# Altium schematic sheet [05]-DOC-REVISION-HISTORY.SchDoc: Stackup & Calculations:
size A3; Ingenieur: Stephan Diel; Organization: Dr. Hönle AG; Address1: Lochhamer Schlag 1; Address2: 82166 Gräfelfing; Address3: Germany; Address4: www.hoenle.de; DocumentNumber: 5; Revision: e01; SheetNumber: 5; SheetTotal: 13
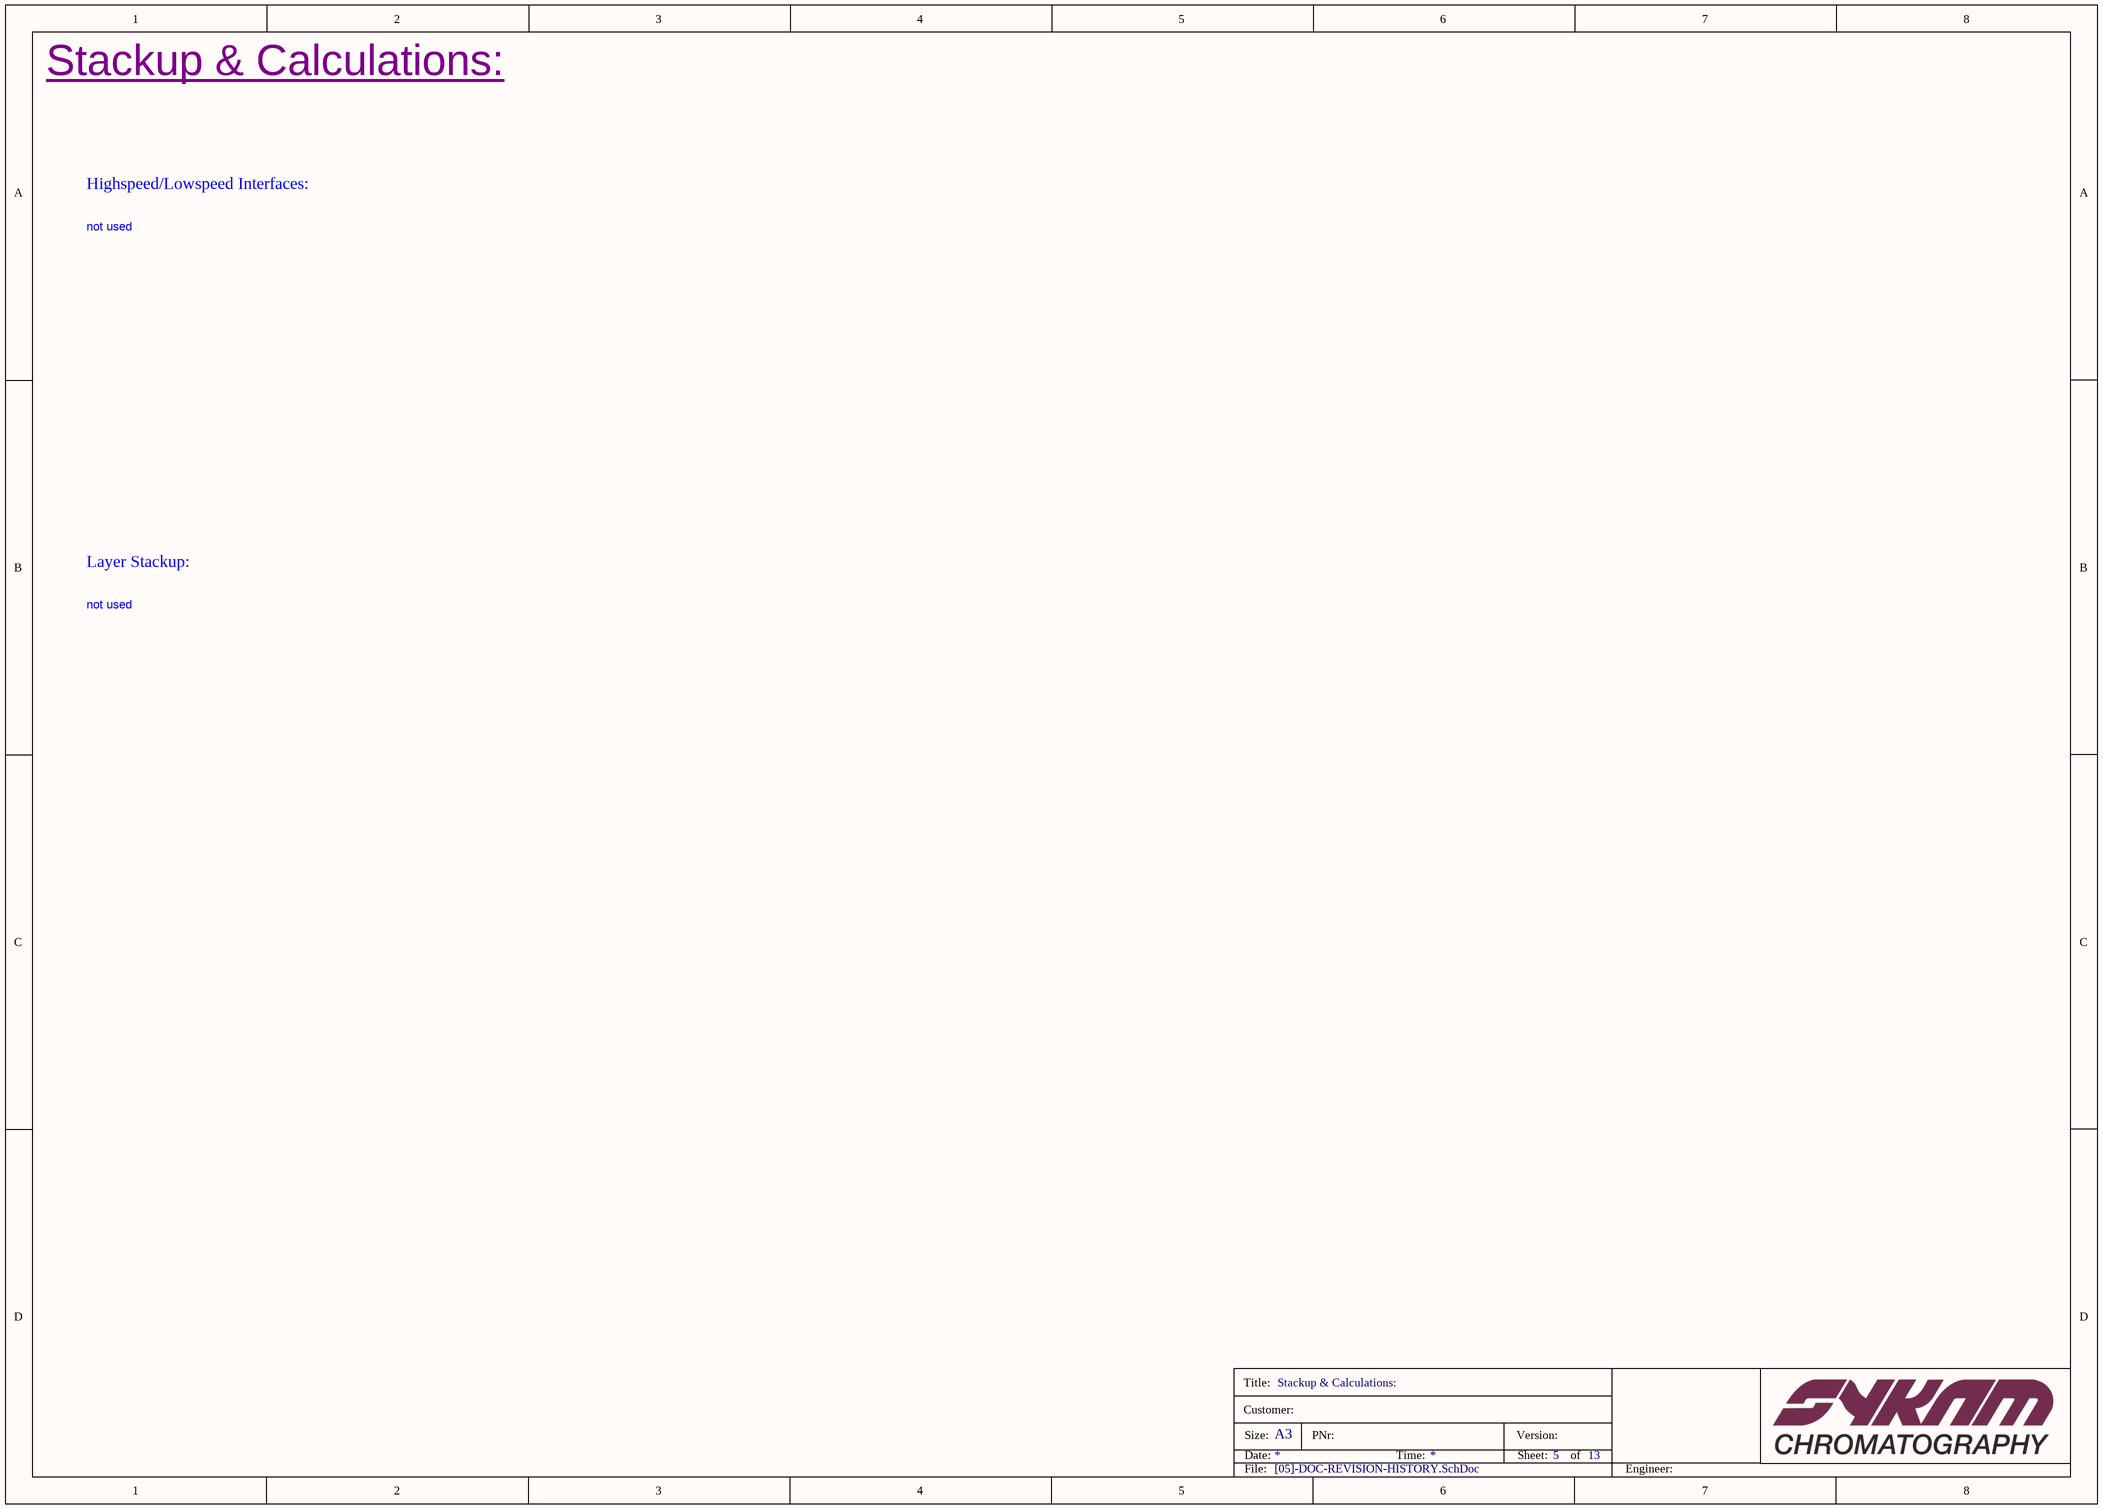
[diagram p0: [05]-DOC-REVISION-HISTORY.SchDoc]

## Notes on the sheet
- Stackup & Calculations:
- Highspeed/Lowspeed Interfaces:
- not used
- Layer Stackup:
- Title:
- Customer:
- Size:
- Date:
- A3
- PNr:
- Time:
- Version:
- Sheet:
- of
- File:
- Engineer: